# EAGLE design mp3 (EAGLE 6.3)
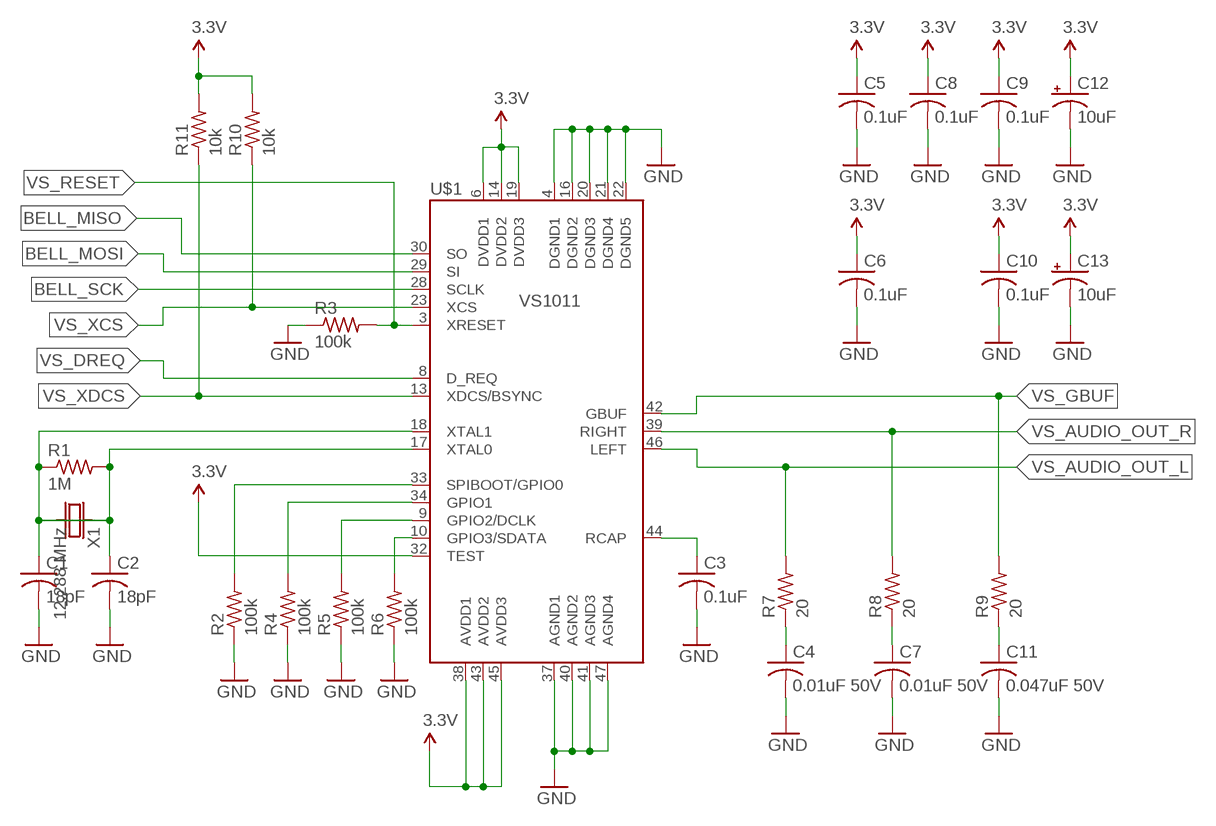
[diagram p0: schematic, sheet 1]

## Parts
C1  18pF  CAP0603  [0603_CAP]
C2  18pF  CAP0603  [0603_CAP]
C3  0.1uF  CAP0603  [0603_CAP]
C4  0.01uF 50V  CAP0603  [0603_CAP]
C5  0.1uF  CAP0603  [0603_CAP]
C6  0.1uF  CAP0603  [0603_CAP]
C7  0.01uF 50V  CAP0603  [0603_CAP]
C8  0.1uF  CAP0603  [0603_CAP]
C9  0.1uF  CAP0603  [0603_CAP]
C10  0.1uF  CAP0603  [0603_CAP]
C11  0.047uF 50V  CAP0603  [0603_CAP]
C12  10uF  CAP_POLB  [B_CAP]
C13  10uF  CAP_POLB  [B_CAP]
R1  1M  RESISTOR0603  [0603_RESISTOR]
R2  100k  RESISTOR0603  [0603_RESISTOR]
R3  100k  RESISTOR0603  [0603_RESISTOR]
R4  100k  RESISTOR0603  [0603_RESISTOR]
R5  100k  RESISTOR0603  [0603_RESISTOR]
R6  100k  RESISTOR0603  [0603_RESISTOR]
R7  20  RESISTOR0603  [0603_RESISTOR]
R8  20  RESISTOR0603  [0603_RESISTOR]
R9  20  RESISTOR0603  [0603_RESISTOR]
R10  10k  RESISTOR0603  [0603_RESISTOR]
R11  10k  RESISTOR0603  [0603_RESISTOR]
U$1  VS1011  [LQFP-48]
X1  12.288 MHz  CRYSTAL5X3  [CRYSTAL_5X3]

## Nets
3.3V: C5.1 C6.1 C8.1 C9.1 C10.1 C12.+ C13.+ R10.2 R11.2 U$1.6(DVDD1) U$1.14(DVDD2) U$1.19(DVDD3) U$1.32(TEST) U$1.38(AVDD1) U$1.43(AVDD2) U$1.45(AVDD3)
BELL_MISO: U$1.30(SO)
BELL_MOSI: U$1.29(SI)
BELL_SCK: U$1.28(SCLK)
GND: C1.2 C2.2 C3.2 C4.2 C5.2 C6.2 C7.2 C8.2 C9.2 C10.2 C11.2 C12.- C13.- R2.1 R3.1 R4.1 R5.1 R6.1 U$1.4(DGND1) U$1.16(DGND2) U$1.20(DGND3) U$1.21(DGND4) U$1.22(DGND5) U$1.37(AGND1) U$1.40(AGND2) U$1.41(AGND3) U$1.47(AGND4)
N$28: C1.1 R1.1 U$1.18(XTAL1) X1.1
N$29: C2.1 R1.2 U$1.17(XTAL0) X1.2
N$30: C3.1 U$1.44(RCAP)
N$32: R6.2 U$1.10(GPIO3/SDATA)
N$33: R5.2 U$1.9(GPIO2/DCLK)
N$34: R4.2 U$1.34(GPIO1)
N$35: R2.2 U$1.33(SPIBOOT/GPIO0)
N$41: C4.1 R7.1
N$42: C7.1 R8.1
N$43: C11.1 R9.1
VS_AUDIO_OUT_L: R7.2 U$1.46(LEFT)
VS_AUDIO_OUT_R: R8.2 U$1.39(RIGHT)
VS_DREQ: U$1.8(D_REQ)
VS_GBUF: R9.2 U$1.42(GBUF)
VS_RESET: R3.2 U$1.3(XRESET)
VS_XCS: R10.1 U$1.23(XCS)
VS_XDCS: R11.1 U$1.13(XDCS/BSYNC)

## Library data of the parts
C1 C2 = jkf:CAP; DIGIKEY#: 445-1272-1-ND
C3 C5 C6 C8-C10 = jkf:CAP; DIGIKEY#: 399-1096-1-ND
C4 C7 = jkf:CAP; DIGIKEY#: 445-1311-1-ND
C11 = jkf:CAP; DIGIKEY#: 445-1313-1-ND
C12 C13 = jkf:CAP_POL; DIGIKEY#: PCE3782CT-ND
R1 = jkf:RESISTOR; DIGIKEY#: 311-1.0MGRCT-ND
R2-R6 R10 R11 = jkf:RESISTOR; DIGIKEY#: 311-100KGRCT-ND
R7-R9 = jkf:RESISTOR; DIGIKEY#: 311-20GRCT-ND
U$1 = jkf:VS1011; MANF: VLSI; MANF#: VS1011E-L
X1 = jkf:CRYSTAL; DIGIKEY#: 887-1082-1-ND

## Board
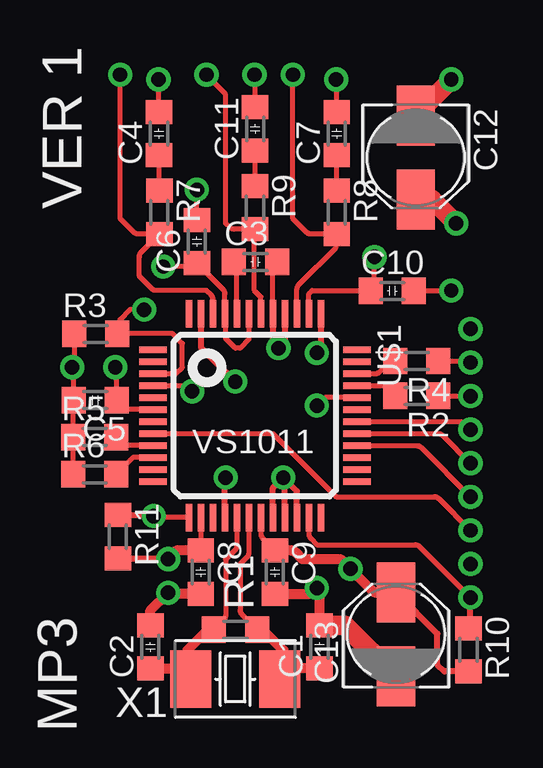
[diagram p1: board, top side]
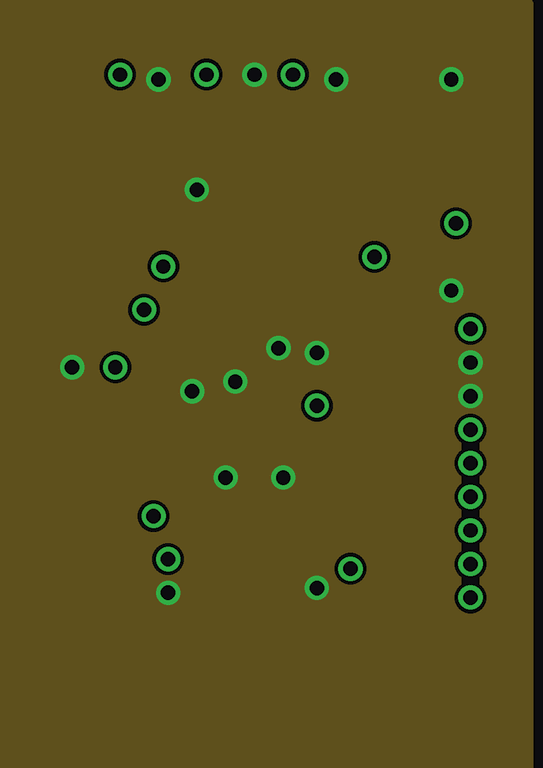
[diagram p2: board, inner layer GND]
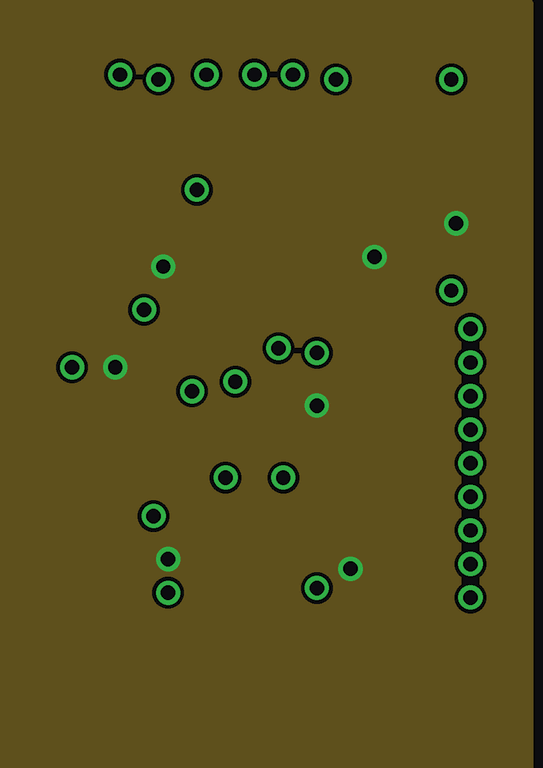
[diagram p3: board, inner layer 3.3V]
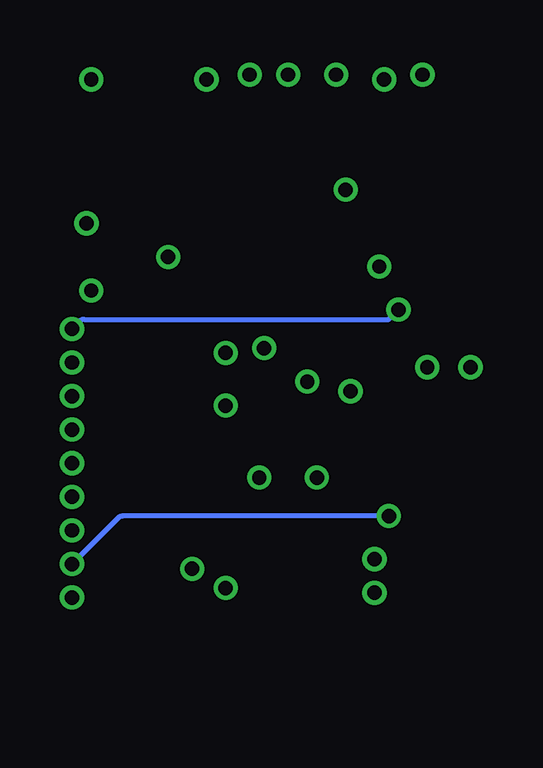
[diagram p4: board, bottom side, seen from below]

No outline drawn. Coordinates in mm, seen from the top.
Copper layers (1+2*15+16): Top 0.0178mm / dielectric 12mil / GND 0.0356mm / dielectric 28mil / 3.3V 0.0356mm / dielectric 12mil / Bottom 0.0178mm
Design rules "SSC-EAGLE-4Lyr_v1.0.0.3": minimum track width 6mil, minimum drill 8mil, track to track 6mil, track to pad 6mil, pad to pad 6mil, via to via 6mil, smd to smd 6mil, copper to edge 20mil, drill to drill 16mil, minimum pad ring 8mil, minimum via ring 8mil, stop-mask expansion 3mil, vias tented up to drill 0mil, thermal gap 10mil

### Footprints (pad centres in the part's own frame; a part is rotated, then mirrored left to right if it is on the bottom)
0603_CAP = smd 1 x 1.1: 1 -0.9,0; 2 0.9,0
B_CAP = smd 2.5 x 1.6: + 1.75,0; - -1.75,0
0603_RESISTOR = smd 1 x 1.1: 1 -0.9,0; 2 0.9,0
LQFP-48 = smd 0.254 x 1.143: 1 -2.75,-4.25; 2 -2.25,-4.25; 3 -1.75,-4.25; 4 -1.25,-4.25; 5 -0.75,-4.25; 6 -0.25,-4.25; 7 0.25,-4.25; 8 0.75,-4.25; 9 1.25,-4.25; 10 1.75,-4.25; 11 2.25,-4.25; 12 2.75,-4.25; 25 2.75,4.25; 26 2.25,4.25; 27 1.75,4.25; 28 1.25,4.25; 29 0.75,4.25; 30 0.25,4.25; 31 -0.25,4.25; 32 -0.75,4.25; 33 -1.25,4.25; 34 -1.75,4.25; 35 -2.25,4.25; 36 -2.75,4.25 | smd 1.143 x 0.254: 13 4.25,-2.75; 14 4.25,-2.25; 15 4.25,-1.75; 16 4.25,-1.25; 17 4.25,-0.75; 18 4.25,-0.25; 19 4.25,0.25; 20 4.25,0.75; 21 4.25,1.25; 22 4.25,1.75; 23 4.25,2.25; 24 4.25,2.75; 37 -4.25,2.75; 38 -4.25,2.25; 39 -4.25,1.75; 40 -4.25,1.25; 41 -4.25,0.75; 42 -4.25,0.25; 43 -4.25,-0.25; 44 -4.25,-0.75; 45 -4.25,-1.25; 46 -4.25,-1.75; 47 -4.25,-2.25; 48 -4.25,-2.75
CRYSTAL_5X3 = smd 1.7 x 2.4: 1 -1.85,0; 2 1.85,0

### Placement (x,y rotation side)
C1  13.58,5.41 90 top
C2  6.53,5.41 90 top
C3  10.91,21.46 0 top
C4  6.89,26.81 90 top
C5  4.23,15.7 180 top
C6  8.47,22.31 90 top
C7  14.3,26.81 90 top
C8  8.63,8.53 270 top
C9  11.72,8.53 270 top
C10  16.61,20.25 0 top
C11  10.9,27.01 90 top
C12  17.59,25.81 270 top
C13  16.77,5.93 90 top
R1  10.08,6.13 180 top
R2  17.63,15.88 180 top
R3  4.26,18.46 0 top
R4  17.63,17.33 180 top
R5  4.21,14.16 0 top
R6  4.21,12.61 0 top
R7  6.91,23.53 270 top
R8  14.3,23.53 270 top
R9  10.89,23.73 270 top
R10  19.79,5.28 270 top
R11  5.18,10.01 270 top
U$1  10.89,15.05 270 top
X1  10.07,4.07 180 top

### Tracks (layer width: path | path; a pad name or v marks a point on that pad's centre or on a via)
3.3V  (via drill 0.6)
  Top 0.203: U$1.14 C8.1 | U$1.32 13.8,15.8 v13.47,15.47 | U$1.6 5.53,15.3 C5.1 5.13,17.01 v5.07,17.07 | U$1.43 10.64,18.24 10.27,17.87 10.07,17.87 9.67,18.27 9.67,19.27 U$1.45 9.64,20.14 arc45 9.57,20.31 C6.1 8.41,21.27 v7.07,21.27 | U$1.38 13.14,20.14 13.27,20.27 15.27,20.27 arc45 15.32,20.25 C10.1 15.8,20.34 arc45 15.87,20.52 v15.87,21.67 | U$1.19 11.14,10.12 arc45 11.21,9.94 C9.1
  Top 0.254: R10.2 18.78,4.38 18.49,4.67 18.49,5.96 C13.+ | R11.2 7.23,9.11 v7.27,9.07
  Top 0.406: v7.27,9.07 7.63,9.43 C8.1 | C9.1 12.4,9.43 arc-45 12.58,9.36 12.87,9.07 14.37,9.07 arc-45 14.54,9 v14.87,8.67 15.79,7.75 arc45 15.96,7.68 C13.+
  Top 0.813: C12.+ 18.28,24.06 v19.27,23.07
  pour 3.3V: 0.27,32.27 22.27,32.27 22.27,0.27 0.27,0.27
BELL_MISO  (via drill 0.6)
  Top 0.203: U$1.30 19.43,14.8 arc-45 19.61,14.73 v19.87,14.47
BELL_MOSI  (via drill 0.6)
  Top 0.203: U$1.29 18.54,14.3 arc-45 18.71,14.23 v19.87,13.07
BELL_SCK  (via drill 0.6)
  Top 0.203: U$1.28 17.64,13.8 arc-45 17.81,13.73 v19.87,11.67
GND  (via drill 0.6)
  Top 0.203: R6.1 R5.1 3.31,15.68 C5.2 3.33,17.01 v3.27,17.07 | C4.2 6.89,29.05 v6.87,29.07 | C7.2 14.3,29.04 v14.27,29.07 | v3.26,17.08 v3.27,17.07 | R3.1 3.36,17.16 v3.27,17.07 | R4.1 19.81,17.33 v19.87,17.27 | R2.1 v19.86,15.88 v19.87,15.87 | U$1.4 7.93,16.3 arc-45 8.11,16.23 v8.27,16.07 | U$1.41 11.64,21.18 arc-45 11.71,21.36 C3.2 | C11.2 10.9,29.2 arc45 v10.87,29.27 | C6.2 v8.47,24.47 | C10.2 arc-45 17.56,20.27 v19.07,20.27
  Top 0.254: U$1.16 9.64,12.44 v9.67,12.47 | U$1.21 12.14,12.4 v12.07,12.47 | U$1.20 11.64,12.04 v12.07,12.47 | U$1.22 12.64,11.9 v12.07,12.47 | U$1.37 13.64,17.84 v13.47,17.67 | U$1.40 12.14,18.14 v11.87,17.87 11.64,18.1 U$1.41 | U$1.47 8.64,17.9 v10.07,16.47
  Top 0.406: C2.2 6.53,6.93 v7.27,7.67 7.31,7.63 C8.2 | C9.2 13.12,7.63 arc45 13.3,7.7 v13.47,7.87 13.51,7.83 arc-45 13.58,7.66 C1.2
  Top 0.813: C1.2 14.64,6.31 C13.- | C12.- 17.59,27.59 v19.07,29.07
  pour GND: 0.27,32.27 22.27,32.27 22.27,0.27 0.27,0.27
N$28
  Top 0.203: U$1.18 10.64,9.35 arc-45 10.57,9.17 10.27,8.87 10.27,6.95 arc45 10.34,6.77 R1.1
  Top 0.406: R1.1 11.11,6.13 arc-45 11.28,6.06 12.07,5.27 12.07,4.33 arc-45 12,4.15 X1.1 12.29,4.44 arc-45 12.46,4.51 C1.1
N$29
  Top 0.203: U$1.17 10.14,9.64 arc-45 10.07,9.47 9.67,9.07 9.67,6.72 arc-45 9.6,6.55 R1.2
  Top 0.406: R1.2 9.04,6.13 arc45 8.86,6.06 8.07,5.27 8.07,4.33 arc45 8.14,4.15 X1.2 7.85,4.44 arc45 7.67,4.51 C2.1
N$30
  Top 0.203: U$1.44 10.14,21.23 arc45 10.07,21.4 C3.1
N$32
  Top 0.203: U$1.10 5.8,13.3 R6.2
N$33
  Top 0.203: U$1.9 5.47,13.8 R5.2
N$34
  Top 0.203: U$1.34 15.89,16.8 arc45 16.07,16.87 16.27,17.07 16.36,17.07 arc45 16.54,17.14 R4.2
N$35
  Top 0.203: U$1.33 16.31,16.3 R2.2
N$41
  Top 0.203: R7.1 6.91,25.89 C4.1
N$42
  Top 0.203: R8.1 C7.1
N$43
  Top 0.203: C11.1 10.89,25.9 R9.1
VS_AUDIO_OUT_L  (via drill 0.6)
  Top 0.203: U$1.46 9.14,19.89 arc45 9.07,20.07 8.87,20.27 6.78,20.27 arc-45 6.6,20.34 6.07,20.87 6.07,21.68 arc-45 6.14,21.86 R7.2 6.01,22.63 arc-45 5.84,22.7 5.27,23.27 v5.27,29.27
VS_AUDIO_OUT_R  (via drill 0.6)
  Top 0.203: U$1.39 12.64,20.34 arc-45 12.71,20.51 14.27,22.07 14.27,22.56 arc-45 R8.2 13.21,22.63 arc-45 13.04,22.7 12.47,23.27 v12.47,29.27
VS_DREQ  (via drill 0.6)
  Top 0.203: U$1.8 11.64,14.3 14.27,11.67 18.36,11.67 arc-45 18.54,11.6 v19.87,10.27
VS_GBUF  (via drill 0.6)
  Top 0.203: U$1.42 11.14,20 10.87,20.27 10.87,22.61 R9.2 | R9.2 11.03,22.63 10.81,22.63 arc-45 10.64,22.7 | R9.2 10.02,22.83 arc-45 9.84,22.9 9.67,23.07 9.67,28.36 arc45 9.6,28.54 v8.87,29.27
VS_RESET  (via drill 0.6)
  Top 0.203: U$1.3 7.6,16.8 7.87,17.07 7.87,18.07 7.47,18.47 R3.2 5.27,18.57 5.27,19.07 5.67,19.47 v6.27,19.47
  Bottom 0.203: v6.27,19.47 6.67,19.07 19.36,19.07 arc-45 19.54,19 v19.87,18.67
VS_XCS  (via drill 0.6)
  Top 0.203: U$1.23 13.14,10.11 arc45 13.21,9.93 13.47,9.67 17.57,9.67 arc-45 17.74,9.6 v19.87,7.47
  Top 0.254: R10.1 19.87,6.18 v19.87,7.47
VS_XDCS  (via drill 0.6)
  Top 0.203: U$1.13 6.74,10.8
  Top 0.254: 6.74,10.8 v6.67,10.87 6.63,10.91 R11.1
  Bottom 0.203: v6.67,10.87 17.77,10.87 arc-45 17.94,10.8 v19.87,8.87

### Text on the board
tPlace: VER 1 | VS1011 | MP3